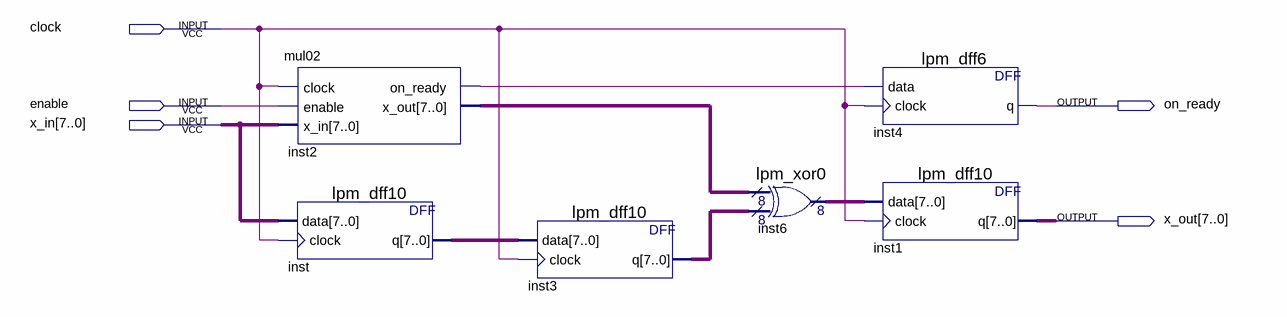
[diagram p0: schematic sheet]
// Quartus schematic mul03.bdf as structural Verilog: 6 symbols, 5 pins
module mul03 (
  input  clock,
  input  enable,
  input  [7:0] x_in,
  output on_ready,
  output [7:0] x_out
);

  wire inst2_on_ready;
  wire [7:0] inst2_x_out, inst3_q, inst6_result, inst_q;

  mul02 inst2 (.clock(clock), .enable(enable), .x_in(x_in), .on_ready(inst2_on_ready), .x_out(inst2_x_out));
  lpm_dff10 inst (.data(x_in), .clock(clock), .q(inst_q));
  lpm_dff10 inst3 (.data(inst_q), .clock(clock), .q(inst3_q));
  lpm_xor0 inst6 (.data0x(inst2_x_out), .data1x(inst3_q), .result(inst6_result));
  lpm_dff6 inst4 (.data(inst2_on_ready), .clock(clock), .q(on_ready));
  lpm_dff10 inst1 (.data(inst6_result), .clock(clock), .q(x_out));
endmodule
